# EAGLE schematic RAC-altimeter (EAGLE 9.4.2)
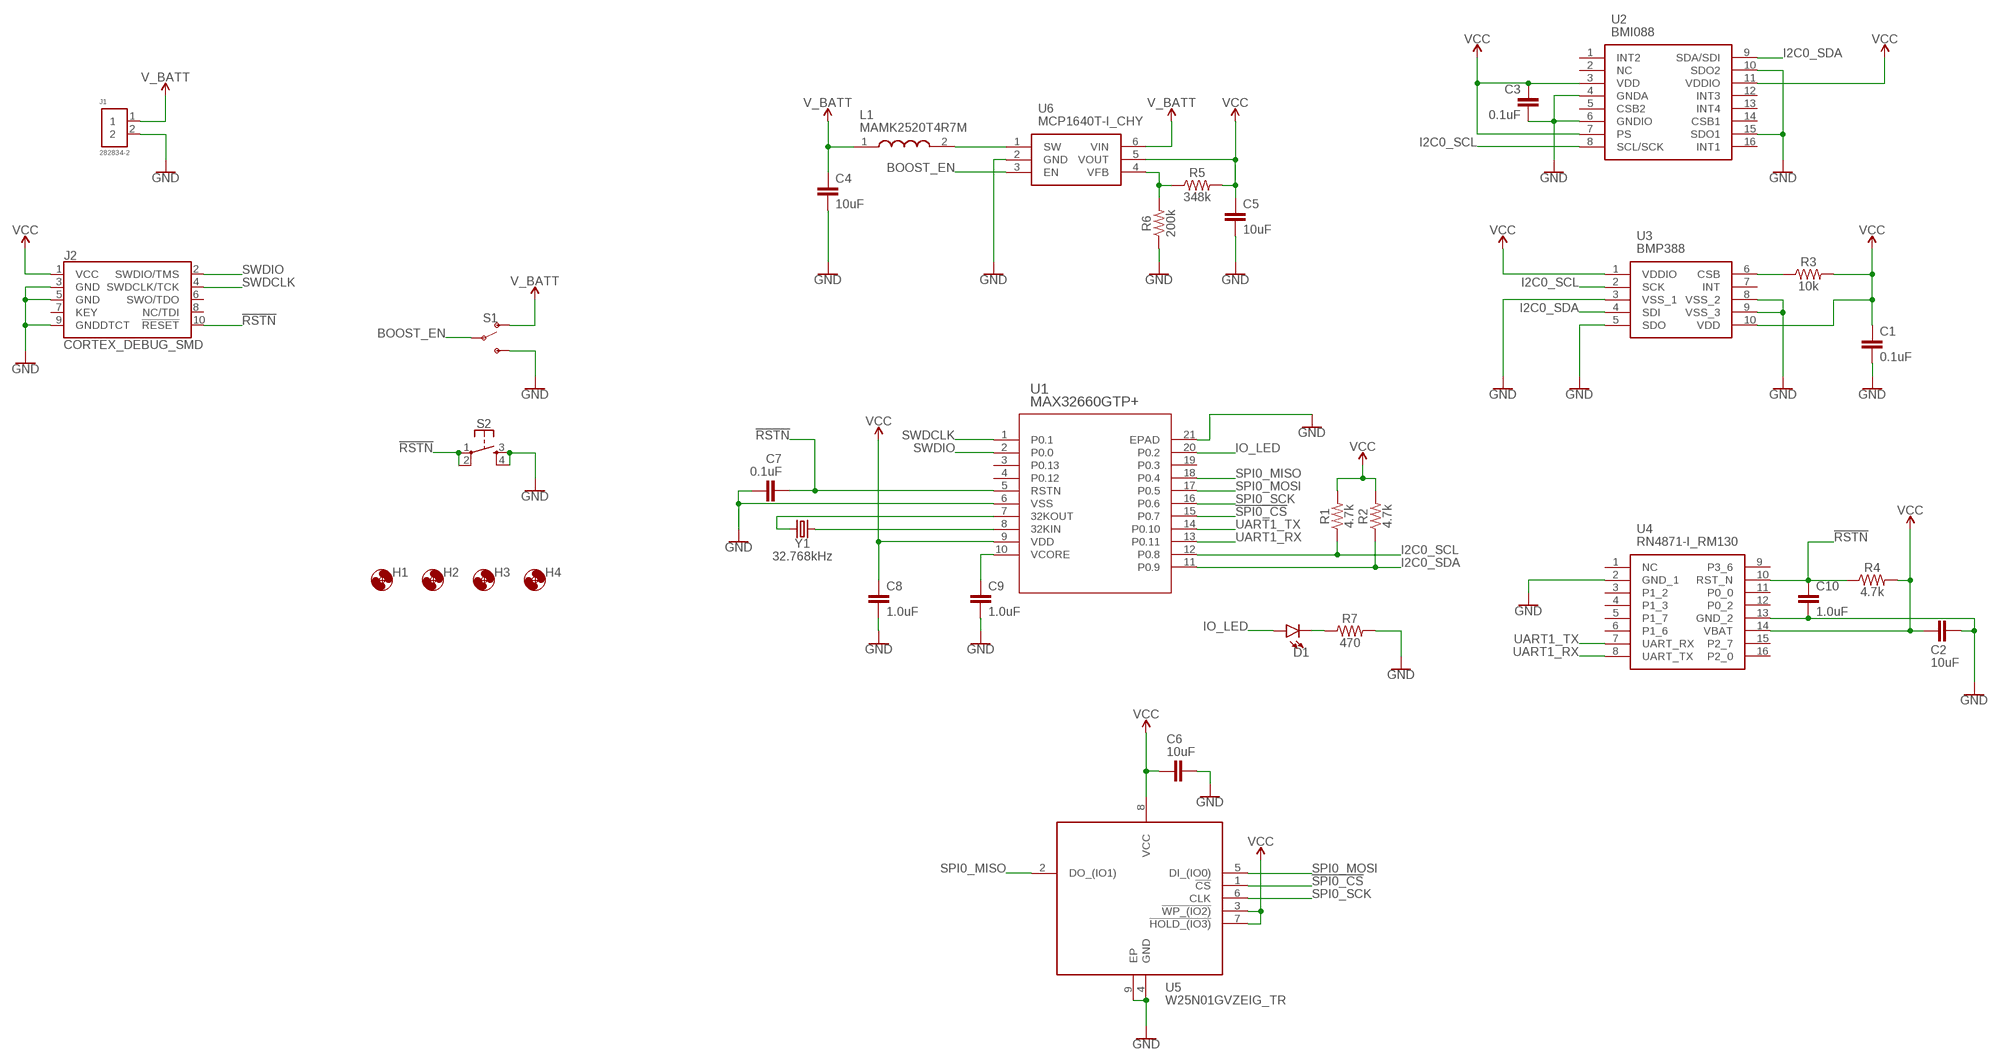
[diagram p0: schematic, sheet 1]

## Parts
C1  0.1uF  0.1UF-0603-25V-(+80/-20%)  [0603]
C2  10uF  10UF-0603-6.3V-20%  [0603]
C3  0.1uF  0.1UF-0603-25V-(+80/-20%)  [0603]
C4  10uF  10UF-0603-6.3V-20%  [0603]
C5  10uF  10UF-0603-6.3V-20%  [0603]
C6  10uF  10UF-0603-6.3V-20%  [0603]
C7  0.1uF  0.1UF-0603-25V-(+80/-20%)  [0603]
C8  1.0uF  1.0UF-0603-16V-10%  [0603]
C9  1.0uF  1.0UF-0603-16V-10%  [0603]
C10  1.0uF  1.0UF-0603-16V-10%  [0603]
D1  LED0603  [LED-0603]
H1  MOUNT-HOLE2.8  [2,8]
H2  MOUNT-HOLE2.8  [2,8]
H3  MOUNT-HOLE2.8  [2,8]
H4  MOUNT-HOLE2.8  [2,8]
J1  282834-2  [CONN_282834-2]
J2  CORTEX_DEBUG_SMD  [SAMTECH_FTSH-105-01]
L1  MAMK2520T4R7M  [INDM2520X120N]
R1  4.7k  4.7KOHM-0603-1/10W-1%  [0603]
R2  4.7k  4.7KOHM-0603-1/10W-1%  [0603]
R3  10k  10KOHM-0603-1/10W-1%  [0603]
R4  4.7k  4.7KOHM-0603-1/10W-1%  [0603]
R5  348k  348KOHM-0603-1/10W-1%  [0603]
R6  200k  200KOHM-0603-1/10W-1%  [0603]
R7  470  470OHM-0603-1/10W-1%  [0603]
S1  SWITCH-SPDT-SMD-AYZ0202  [SWITCH_DPDT_SMD_AYZ0202]
S2  MOMENTARY-SWITCH-SPST-2-SMD-4.6X2.8MM  [TACTILE_SWITCH_SMD_4.6X2.8MM]
U1  MAX32660GTP+  [21-0139V_T2044+5]
U2  BMI088  [BMI088]
U3  BMP388  [BMP388]
U4  RN4871-I_RM130  [RN4871]
U5  W25N01GVZEIG_TR  [SON127P800X600X80-9N]
U6  MCP1640T-I_CHY  [SOT95P270X145-6N]
Y1  32.768kHz  CRYSTAL-32.768KHZSMD-3.2X1.5  [CRYSTAL-SMD-3.2X1.5MM]

## Nets
32KIN: U1.8(32KIN) Y1.P$1
32KOUT: U1.7(32KOUT) Y1.P$2
!RSTN: C7.1 C10.1 J2.10(!RESET) R4.1 S2.1 S2.2 U1.5(RSTN) U4.10(RST_N)
!SPI0_CS: U1.15(P0.7) U5.1(!CS)
BMP_CS: R3.1 U3.6(CSB)
BOOST_EN: S1.2(P) U6.3(EN)
GND: C1.2 C2.2 C3.2 C4.2 C5.2 C6.2 C7.2 C8.2 C9.2 C10.2 J1.2 J2.3(GND) J2.5(GND) J2.9(GNDDTCT) R6.1 R7.2 S1.3(S) S2.3 S2.4 U1.6(VSS) U1.21(EPAD) U2.4(GNDA) U2.6(GNDIO) U2.10(SDO2) U2.15(SDO1) U3.3(VSS_1) U3.5(SDO) U3.8(VSS_2) U3.9(VSS_3) U4.2(GND_1) U4.13(GND_2) U5.4(GND) U5.9(EP) U6.2(GND)
I2C0_SCL: R1.1 U1.12(P0.8) U2.8(SCL/SCK) U3.2(SCK)
I2C0_SDA: R2.1 U1.11(P0.9) U2.9(SDA/SDI) U3.4(SDI)
IO_LED: D1.A U1.20(P0.2)
LED_CATH: D1.C R7.1
SPI0_MISO: U1.18(P0.4) U5.2(DO_(IO1))
SPI0_MOSI: U1.17(P0.5) U5.5(DI_(IO0))
SPI0_SCK: U1.16(P0.6) U5.6(CLK)
SW: L1.2 U6.1(SW)
SWDCLK: J2.4(SWDCLK/TCK) U1.1(P0.1)
SWDIO: J2.2(SWDIO/TMS) U1.2(P0.0)
UART1_RX: U1.13(P0.11) U4.8(UART_TX)
UART1_TX: U1.14(P0.10) U4.7(UART_RX)
V_BATT: C4.1 J1.1 L1.1 S1.1(O) U6.6(VIN)
VCC: C1.1 C2.1 C3.1 C5.1 C6.1 C8.1 J2.1(VCC) R1.2 R2.2 R3.2 R4.2 R5.2 U1.9(VDD) U2.3(VDD) U2.7(PS) U2.11(VDDIO) U3.1(VDDIO) U3.10(VDD) U4.14(VBAT) U5.3(!WP_(IO2)) U5.7(!HOLD_(IO3)) U5.8(VCC) U6.5(VOUT)
VCORE: C9.1 U1.10(VCORE)
VFB: R5.1 R6.2 U6.4(VFB)
Unconnected: J2.6(SWO/TDO) J2.7(KEY) J2.8(NC/TDI) U1.3(P0.13) U1.4(P0.12) U1.19(P0.3) U2.1(INT2) U2.2(NC) U2.5(CSB2) U2.12(INT3) U2.13(INT4) U2.14(CSB1) U2.16(INT1) U3.7(INT) U4.1(NC) U4.3(P1_2) U4.4(P1_3) U4.5(P1_7) U4.6(P1_6) U4.9(P3_6) U4.11(P0_0) U4.12(P0_2) U4.15(P2_7) U4.16(P2_0)

## Library data of the parts
C1 C3 C7 = SparkFun-Capacitors:0.1UF: 0.1µF ceramic capacitors A capacitor is a passive two-terminal electrical component used to store electrical energy temporarily in an electric field.; PROD_ID: CAP-00810
C2 C4-C6 = SparkFun-Capacitors:10UF: 10.0µF ceramic capacitors A capacitor is a passive two-terminal electrical component used to store electrical energy temporarily in an electric field.; PROD_ID: CAP-11015
C8-C10 = SparkFun-Capacitors:1.0UF: 1µF ceramic capacitors A capacitor is a passive two-terminal electrical component used to store electrical energy temporarily in an electric field.; PROD_ID: CAP-00868
D1 = SparkFun-LED:LED: LED (Generic) Standard schematic elements and footprints for 5mm, 3mm, 1206, and 0603 sized LEDs. Generic LEDs with no color specified.
H1-H4 = holes:MOUNT-HOLE: MOUNTING HOLE with drill center marker
J1 = RAC-Altimeter:282834-2: Terminal block; 2.54mm; angled 90°; 0.03÷1mm2; ways: 2; 10A; H: 10mm; CENTERLINE_PITCH: 2.54 mm[.1 in]; COMMENT: 282834-2; DESCRIPTION: TERMI-BLOK PCB MOUNT, 90 2P.; DIGI-KEY_PART_NUMBER: A98333-ND; DIGI-KEY_PURCHASE_URL: https://www.digikey.com/product-detail/en/te-connectivity-amp-connectors/282834-2/A98333-ND/1150135?utm_source=snapeda&utm_medium=aggregator&utm_campaign=symbol; EU_ROHS_COMPLIANCE: Compliant with Exemptions; MF: TE Connectivity; MP: 282834-2; NUMBER_OF_POSITIONS: 2; PACKAGE: None; TE_PURCHASE_URL: https://www.te.com/usa-en/product-282834-2.html?te_bu=Cor&te_type=disp&te_campaign=seda_glo_cor-seda-global-disp-prtnr-fy19-seda-model-bom-cta_sma-317_1&elqCampaignId=32493
J2 = SparkFun-Connectors:CORTEX_DEBUG: Cortex Debug Connector - 10 pin Supports JTAG debug, Serial Wire debug, and Serial Wire Viewer. PTH and SMD connector options available. General Connector Information <http://infocenter.arm.com/help/topic/com.arm.doc.faqs/attached/13634/cortex_debug_connectors.pdf> Products: PTH Connector <http://www.digikey.com/product-detail/en/cnc-tech/3220-10-0100-00/1175-1627-ND/3883661> -via Digi-Key SparkFun PSoc <https://www.sparkfun.com/products/13229> SparkFun T <https://www.sparkfun.com/products/13810>
L1 = RAC-Altimeter:MAMK2520T4R7M: TAIYO YUDEN - MAMK2520T4R7M - INDUCTOR, SHIELDED, 4.7UH, 1.5A, SMD Source: Datasheet <https://mouser.componentsearchengine.com/Datasheets/2/MAMK2520T4R7M.pdf>; DESCRIPTION: TAIYO YUDEN - MAMK2520T4R7M - INDUCTOR, SHIELDED, 4.7UH, 1.5A, SMD; HEIGHT: 1.2mm; MANUFACTURER_NAME: TAIYO YUDEN; MANUFACTURER_PART_NUMBER: MAMK2520T4R7M
R1 R2 R4 = SparkFun-Resistors:4.7KOHM: 4.7kΩ resistor A resistor is a passive two-terminal electrical component that implements electrical resistance as a circuit element. Resistors act to reduce current flow, and, at the same time, act to lower voltage levels within circuits. - Wikipedia; PROD_ID: RES-07857
R3 = SparkFun-Resistors:10KOHM: 10kΩ resistor A resistor is a passive two-terminal electrical component that implements electrical resistance as a circuit element. Resistors act to reduce current flow, and, at the same time, act to lower voltage levels within circuits. - Wikipedia; PROD_ID: RES-00824
R5 = SparkFun-Resistors:348KOHM: 348kΩ resistor A resistor is a passive two-terminal electrical component that implements electrical resistance as a circuit element. Resistors act to reduce current flow, and, at the same time, act to lower voltage levels within circuits. - Wikipedia; PROD_ID: RES-12533
R6 = SparkFun-Resistors:200KOHM: 200kΩ resistor A resistor is a passive two-terminal electrical component that implements electrical resistance as a circuit element. Resistors act to reduce current flow, and, at the same time, act to lower voltage levels within circuits. - Wikipedia; PROD_ID: RES-09385
R7 = SparkFun-Resistors:470OHM: 470Ω resistor A resistor is a passive two-terminal electrical component that implements electrical resistance as a circuit element. Resistors act to reduce current flow, and, at the same time, act to lower voltage levels within circuits. - Wikipedia; PROD_ID: RES-07869
S1 = SparkFun-Switches:SWITCH-SPDT: Single Pole, Double Throw (SPDT) Switch Single-pole, double-throw (SPDT) switch. Variant Overview SMD-AYZ0202 Surface Mount DPDT Switch <https://www.sparkfun.com/products/597> (COM-00597) Used on e.g. LilyPad Arduino USB - ATmega32U4 Board <https://www.sparkfun.com/products/12049> PTH-11.6X4.0MM SPDT Mini Power Switch <https://www.sparkfun.com/products/102> (COM-00102) Used on e.g. SparkFun Simon Says - Through-Hole Soldering Kit <https://www.sparkfun.com/products/10547> (KIT-10547) PTH-11.6X4.0MM-KIT KIT version of SPDT Mini Power Switch - Simplifies soldering by removing tStop of switch pins - only one side can be soldered. PTH-11.6X4.0MM-LOCK LOCK version of SPDT Mini Power Switch - Offset pins hold switch in place for easier soldering. SMD-RIGHT-ANGLE Surface Mount Right Angle Switch <https://www.sparkfun.com/products/10860> (COM-10860) Used on e.g. SparkFun ESP8266 Thing <https://www.sparkfun.com/products/13231>; PROD_ID: SWCH-08179; SF_ID: COM-00597
S2 = SparkFun-Switches:MOMENTARY-SWITCH-SPST-2: Momentary Switch (Pushbutton) - SPST - Two Circuits Normally-open (NO) SPST momentary switches (buttons, pushbuttons). Schematic symbol includes two switch circuits. Variants SMD-4.6MMX2.8MM - 4.60mm x 2.80mm Tactile Momentary Button Switch - Used on SparkFun SAMD21 Mini Breakout <https://www.sparkfun.com/products/13664> SMD-5.2MM - Mini Pushbutton Switch - SMD <https://www.sparkfun.com/products/8720> - Used on Arduino Pro Mini <https://www.sparkfun.com/products/11114>; PROD_ID: SWCH-13065
U1 = RAC-Altimeter:MAX32660GTP+; MANUFACTURER_PART_NUMBER: MAX32660GTP+; VENDOR: Maxim Integrated Products
U2 = BMI088:BMI088: Inertial Measurement Unit Digital Output 2.5V/3.3V Automotive Source: Datasheet <https://www.mouser.de/datasheet/2/783/BST-BMI088-DS001-13-1479671.pdf>; DESCRIPTION: Inertial Measurement Unit Digital Output 2.5V/3.3V Automotive; HEIGHT: 1.45mm; MANUFACTURER_NAME: Bosch; MANUFACTURER_PART_NUMBER: BMI088; MOUSER_PART_NUMBER: 262-BMI088
U3 = BMP388:BMP388: Board Mount Pressure Sensors MEMS Absolute Barometric Pressure Sensor Source: Datasheet <https://br.mouser.com/datasheet/2/783/BST-BMP388-DS001-01-1307765.pdf>; DESCRIPTION: Board Mount Pressure Sensors MEMS Absolute Barometric Pressure Sensor; HEIGHT: 0.8mm; MANUFACTURER_NAME: Bosch; MANUFACTURER_PART_NUMBER: BMP388; MOUSER_PART_NUMBER: 262-BMP388
U4 = RAC-Altimeter:RN4871-I_RM130: Bluetooth BLE Module, Shielded, Antenna, Source: Datasheet <https://componentsearchengine.com/Datasheets/1/RN4871-I_RM130.pdf>; DESCRIPTION: Bluetooth BLE Module, Shielded, Antenna,; HEIGHT: mm; MANUFACTURER_NAME: Microchip; MANUFACTURER_PART_NUMBER: RN4871-I/RM130; MOUSER_PART_NUMBER: 579-RN4871IRM130; MOUSER_PRICE-STOCK: https://www.mouser.com/Search/Refine.aspx?Keyword=579-RN4871IRM130
U5 = RAC-Altimeter:W25N01GVZEIG_TR: IC FLASH 1GBIT 104MHZ 8WSON Source: Datasheet <https://componentsearchengine.com/Datasheets/1/W25N01GVZEIG TR.pdf>; DESCRIPTION: IC FLASH 1GBIT 104MHZ 8WSON; HEIGHT: 0.8mm; MANUFACTURER_NAME: Winbond; MANUFACTURER_PART_NUMBER: W25N01GVZEIG TR; MOUSER_PART_NUMBER: 454-W25N01GVZEIGTR; MOUSER_PRICE-STOCK: https://www.mouser.com/Search/Refine.aspx?Keyword=454-W25N01GVZEIGTR
U6 = RAC-Altimeter:MCP1640T-I_CHY: Microchip MCP1640T-I/CHY, Boost Converter, Step Up 0.35A Adjustable, 2 5.5 V, 575 kHz, 6-pin SOT-23 Source: Datasheet <https://componentsearchengine.com/Datasheets/1/MCP1640T-I_CHY.pdf>; DESCRIPTION: Microchip MCP1640T-I/CHY, Boost Converter, Step Up 0.35A Adjustable, 2 5.5 V, 575 kHz, 6-pin SOT-23; HEIGHT: 1.45mm; MANUFACTURER_NAME: Microchip; MANUFACTURER_PART_NUMBER: MCP1640T-I/CHY; MOUSER_PART_NUMBER: 579-MCP1640TI/CHY; MOUSER_PRICE-STOCK: https://www.mouser.com/Search/Refine.aspx?Keyword=579-MCP1640TI%2FCHY
Y1 = SparkFun-Clocks:CRYSTAL-32.768KHZ: 32.768kHz Crystal Frequency: 32.768kHz Frequency Stability: ±20ppm Load Capacitance: 12.5pF (PTH-2X6 & SMD-3.2X1.5), 6pF (SMD-2X6) SparkFun Products: SparkFun BigTime Watch Kit <https://www.sparkfun.com/products/11734> SparkFun nRF52832 Breakout <https://www.sparkfun.com/products/13990> SparkFun Real Time Clock Module <https://www.sparkfun.com/products/12708>; PROD_ID: XTAL-13062